# EasyEDA schematic 20 character HP DL1414 display with SN74HC595N shift registers.json
TITLE: 20 character HP DL 1414 display; REV: 1.0; Date: 2020-01-12; Sheet: 1/1; Drawn By: effevee; Company: VergoSoft
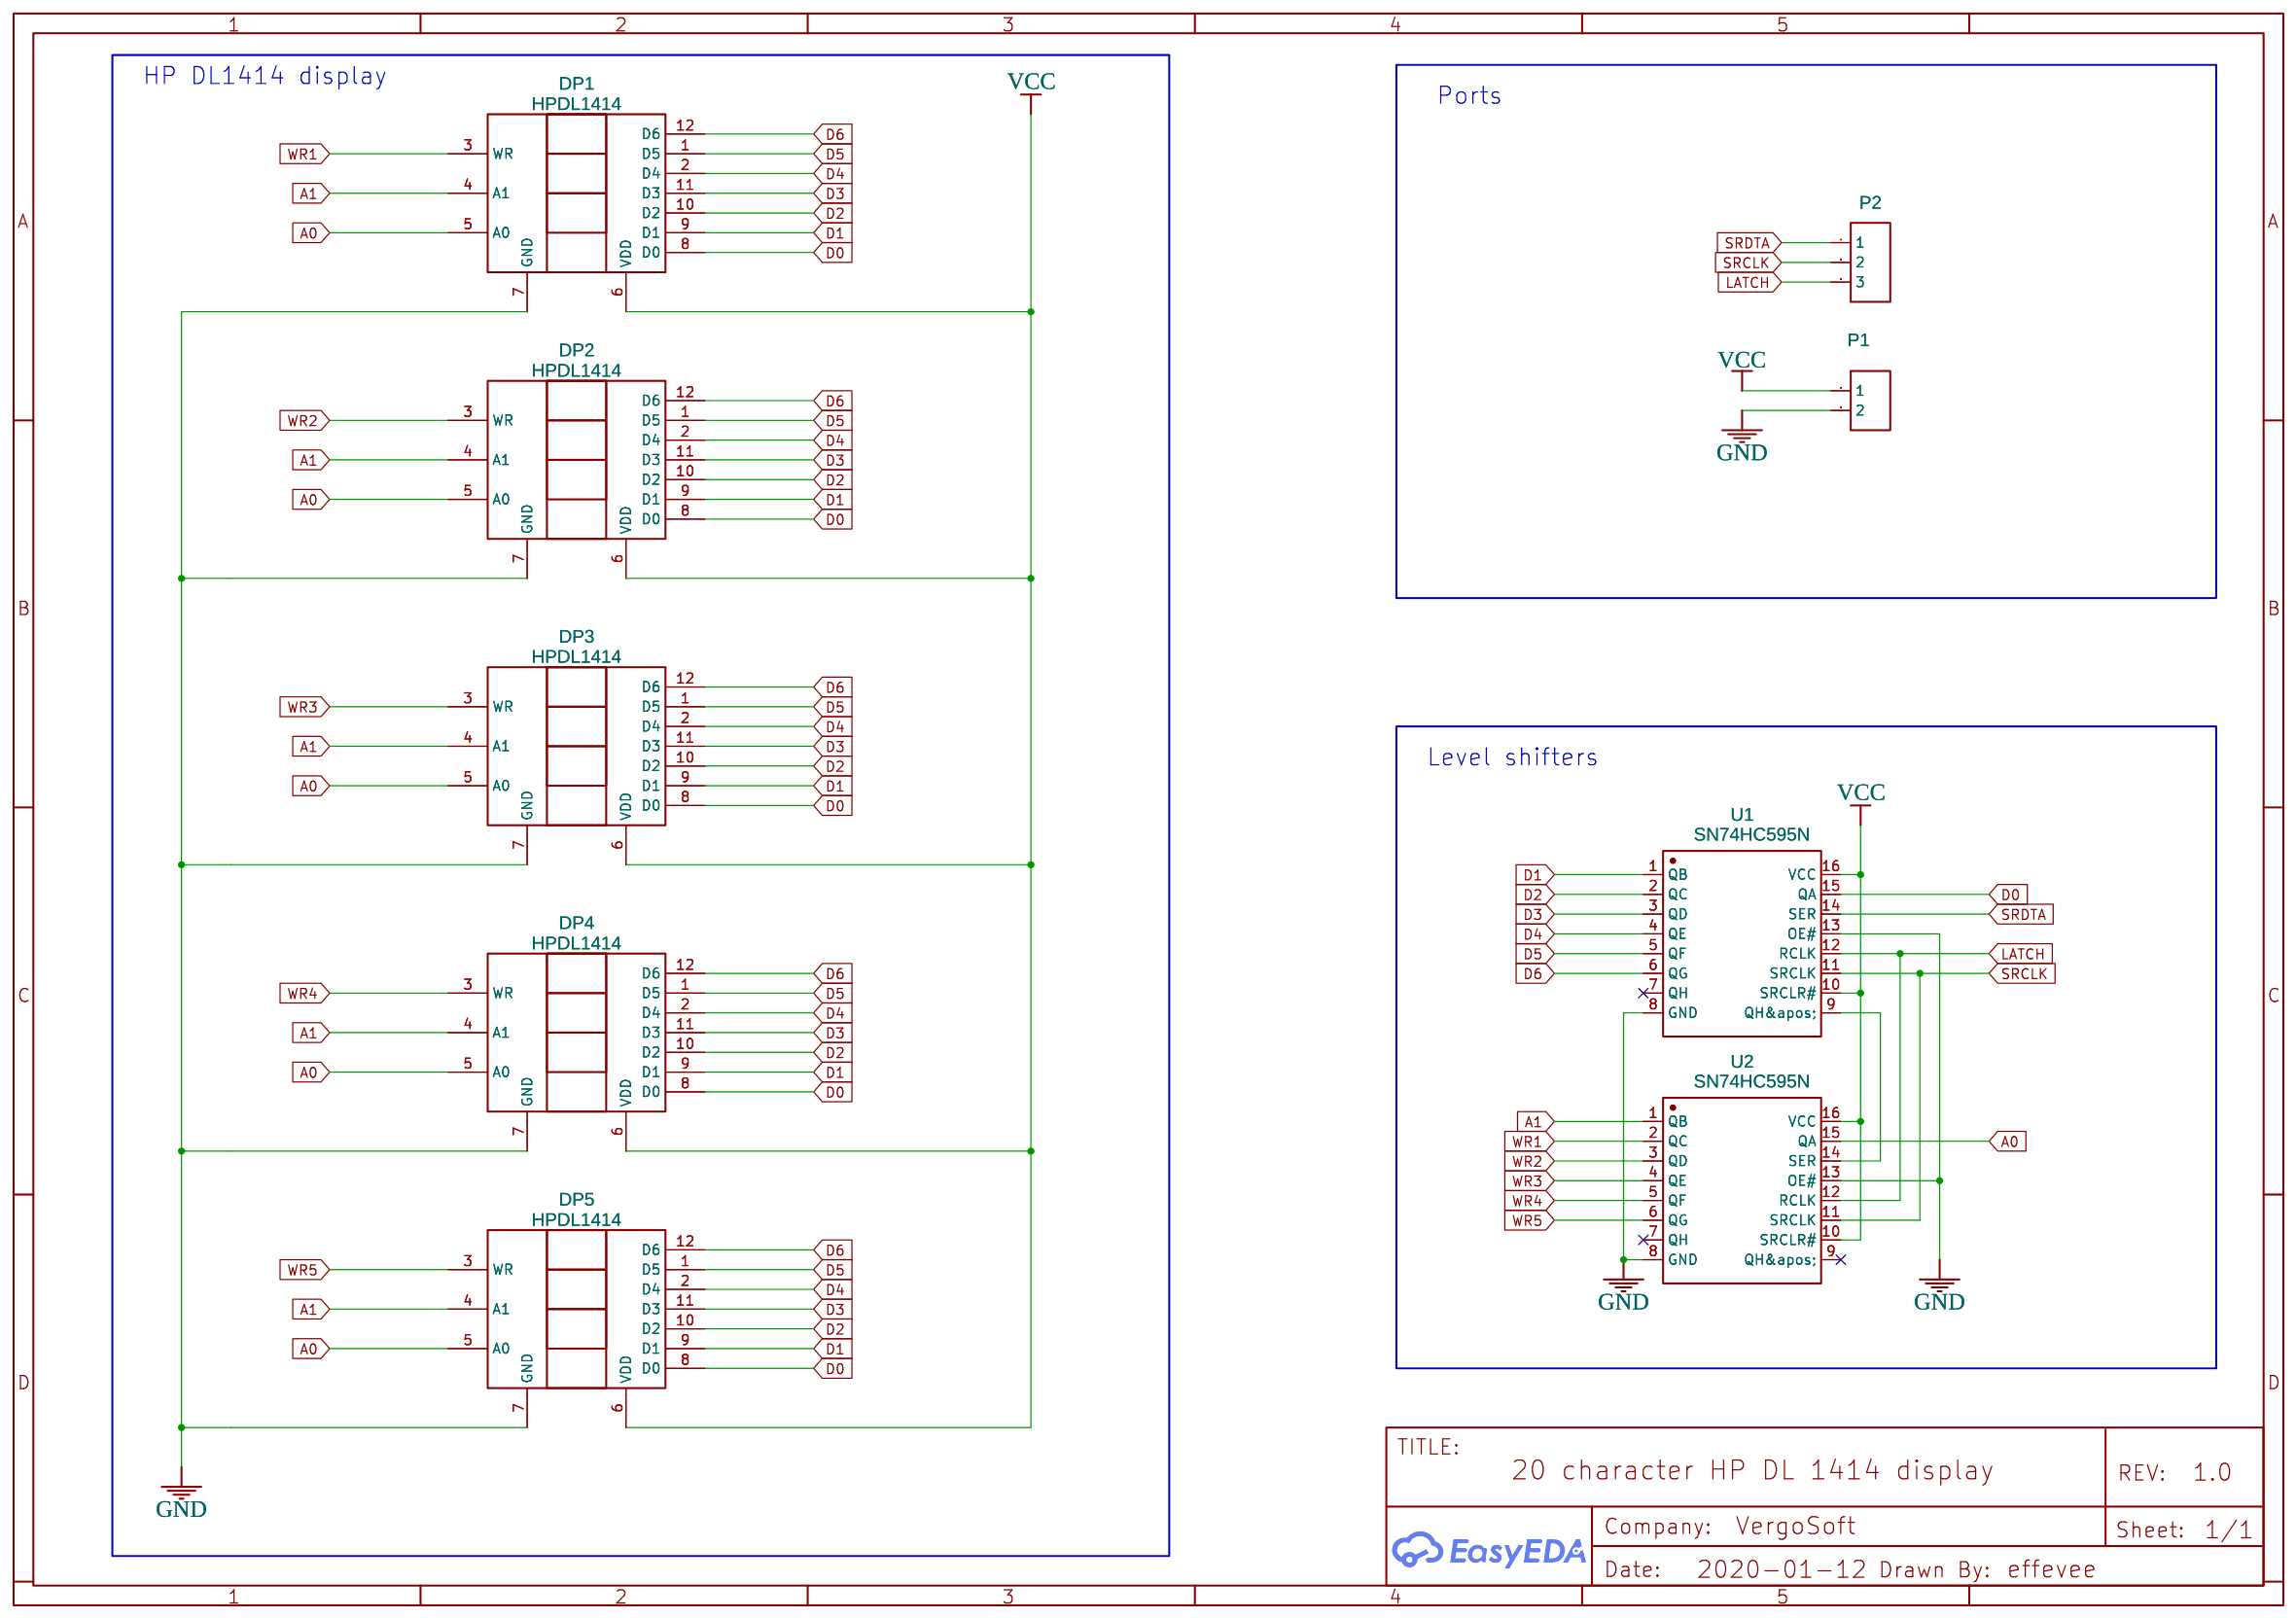
[diagram p0: schematic sheet]

## Parts
DP1  HPDL1414  [HPDL-1414 TUX]
DP2  HPDL1414  [HPDL-1414 TUX]
DP3  HPDL1414  [HPDL-1414 TUX]
DP4  HPDL1414  [HPDL-1414 TUX]
DP5  HPDL1414  [HPDL-1414 TUX]
P1  Header-Female-2.54_1x2  [HDR-TH_2P-P2.54-V-M]
P2  Header-Female-2.54_1x3  [HDR-TH_3P-P2.54-V]
U1  SN74HC595N  [DIP-16_L19.8-W6.5-P2.54-LS7.6-BL]
U2  SN74HC595N  [DIP-16_L19.8-W6.5-P2.54-LS7.6-BL]

## Library data of the parts
DP1-DP5 = HPDL1414 EFFEVEE: catid: 20; Contributor: L p; Supplier Part: HPDL-1414; sim: true
P1 = Header-Female-2.54_1x2: Supplier: LCSC; Manufacturer: BOOMELE; Manufacturer Part: 2.54-1*2PFemale; image: //image.lceda.cn/szlcsc/C49661.jpg; Supplier Part: C49661
P2 = Header-Female-2.54_1x3: Supplier Part: C146243; Supplier: LCSC; Manufacturer: Boom Precision Elec; link: https://datasheet.lcsc.com/szlcsc/Boom-Precision-Elec-2-54mm-1-8P-Straight-Female-header_C27438.pdf
U1 U2 = SN74HC595N: Supplier: LCSC; Manufacturer: TI; image: //image.lceda.cn/szlcsc/C78711.jpg; Supplier Part: C78711

## Nets
GND: DP1.7(GND) DP2.7(GND) DP3.7(GND) DP4.7(GND) DP5.7(GND) P1.2 U1.8(GND) U1.13(OE#) U2.8(GND) U2.13(OE#)
VCC: DP1.6(VDD) DP2.6(VDD) DP3.6(VDD) DP4.6(VDD) DP5.6(VDD) P1.1 U1.10(SRCLR#) U1.16(VCC) U2.10(SRCLR#) U2.16(VCC)
A0: DP1.5(A0) DP2.5(A0) DP3.5(A0) DP4.5(A0) DP5.5(A0) U2.15(QA)
A1: DP1.4(A1) DP2.4(A1) DP3.4(A1) DP4.4(A1) DP5.4(A1) U2.1(QB)
D0: DP1.8(D0) DP2.8(D0) DP3.8(D0) DP4.8(D0) DP5.8(D0) U1.15(QA)
D1: DP1.9(D1) DP2.9(D1) DP3.9(D1) DP4.9(D1) DP5.9(D1) U1.1(QB)
D2: DP1.10(D2) DP2.10(D2) DP3.10(D2) DP4.10(D2) DP5.10(D2) U1.2(QC)
D3: DP1.11(D3) DP2.11(D3) DP3.11(D3) DP4.11(D3) DP5.11(D3) U1.3(QD)
D4: DP1.2(D4) DP2.2(D4) DP3.2(D4) DP4.2(D4) DP5.2(D4) U1.4(QE)
D5: DP1.1(D5) DP2.1(D5) DP3.1(D5) DP4.1(D5) DP5.1(D5) U1.5(QF)
D6: DP1.12(D6) DP2.12(D6) DP3.12(D6) DP4.12(D6) DP5.12(D6) U1.6(QG)
LATCH: P2.3 U1.12(RCLK) U2.12(RCLK)
SRCLK: P2.2 U1.11(SRCLK) U2.11(SRCLK)
SRDTA: P2.1 U1.14(SER)
WR1: DP1.3(WR) U2.2(QC)
WR2: DP2.3(WR) U2.3(QD)
WR3: DP3.3(WR) U2.4(QE)
WR4: DP4.3(WR) U2.5(QF)
WR5: DP5.3(WR) U2.6(QG)
Net-(U1-9): U1.9(QH') U2.14(SER)

Not connected (* = marked no-connect by the designer): U1 7(QH)*; U2 7(QH)* 9(QH')*

## Notes on the sheet
- HP DL1414 display
- Ports
- Level shifters
